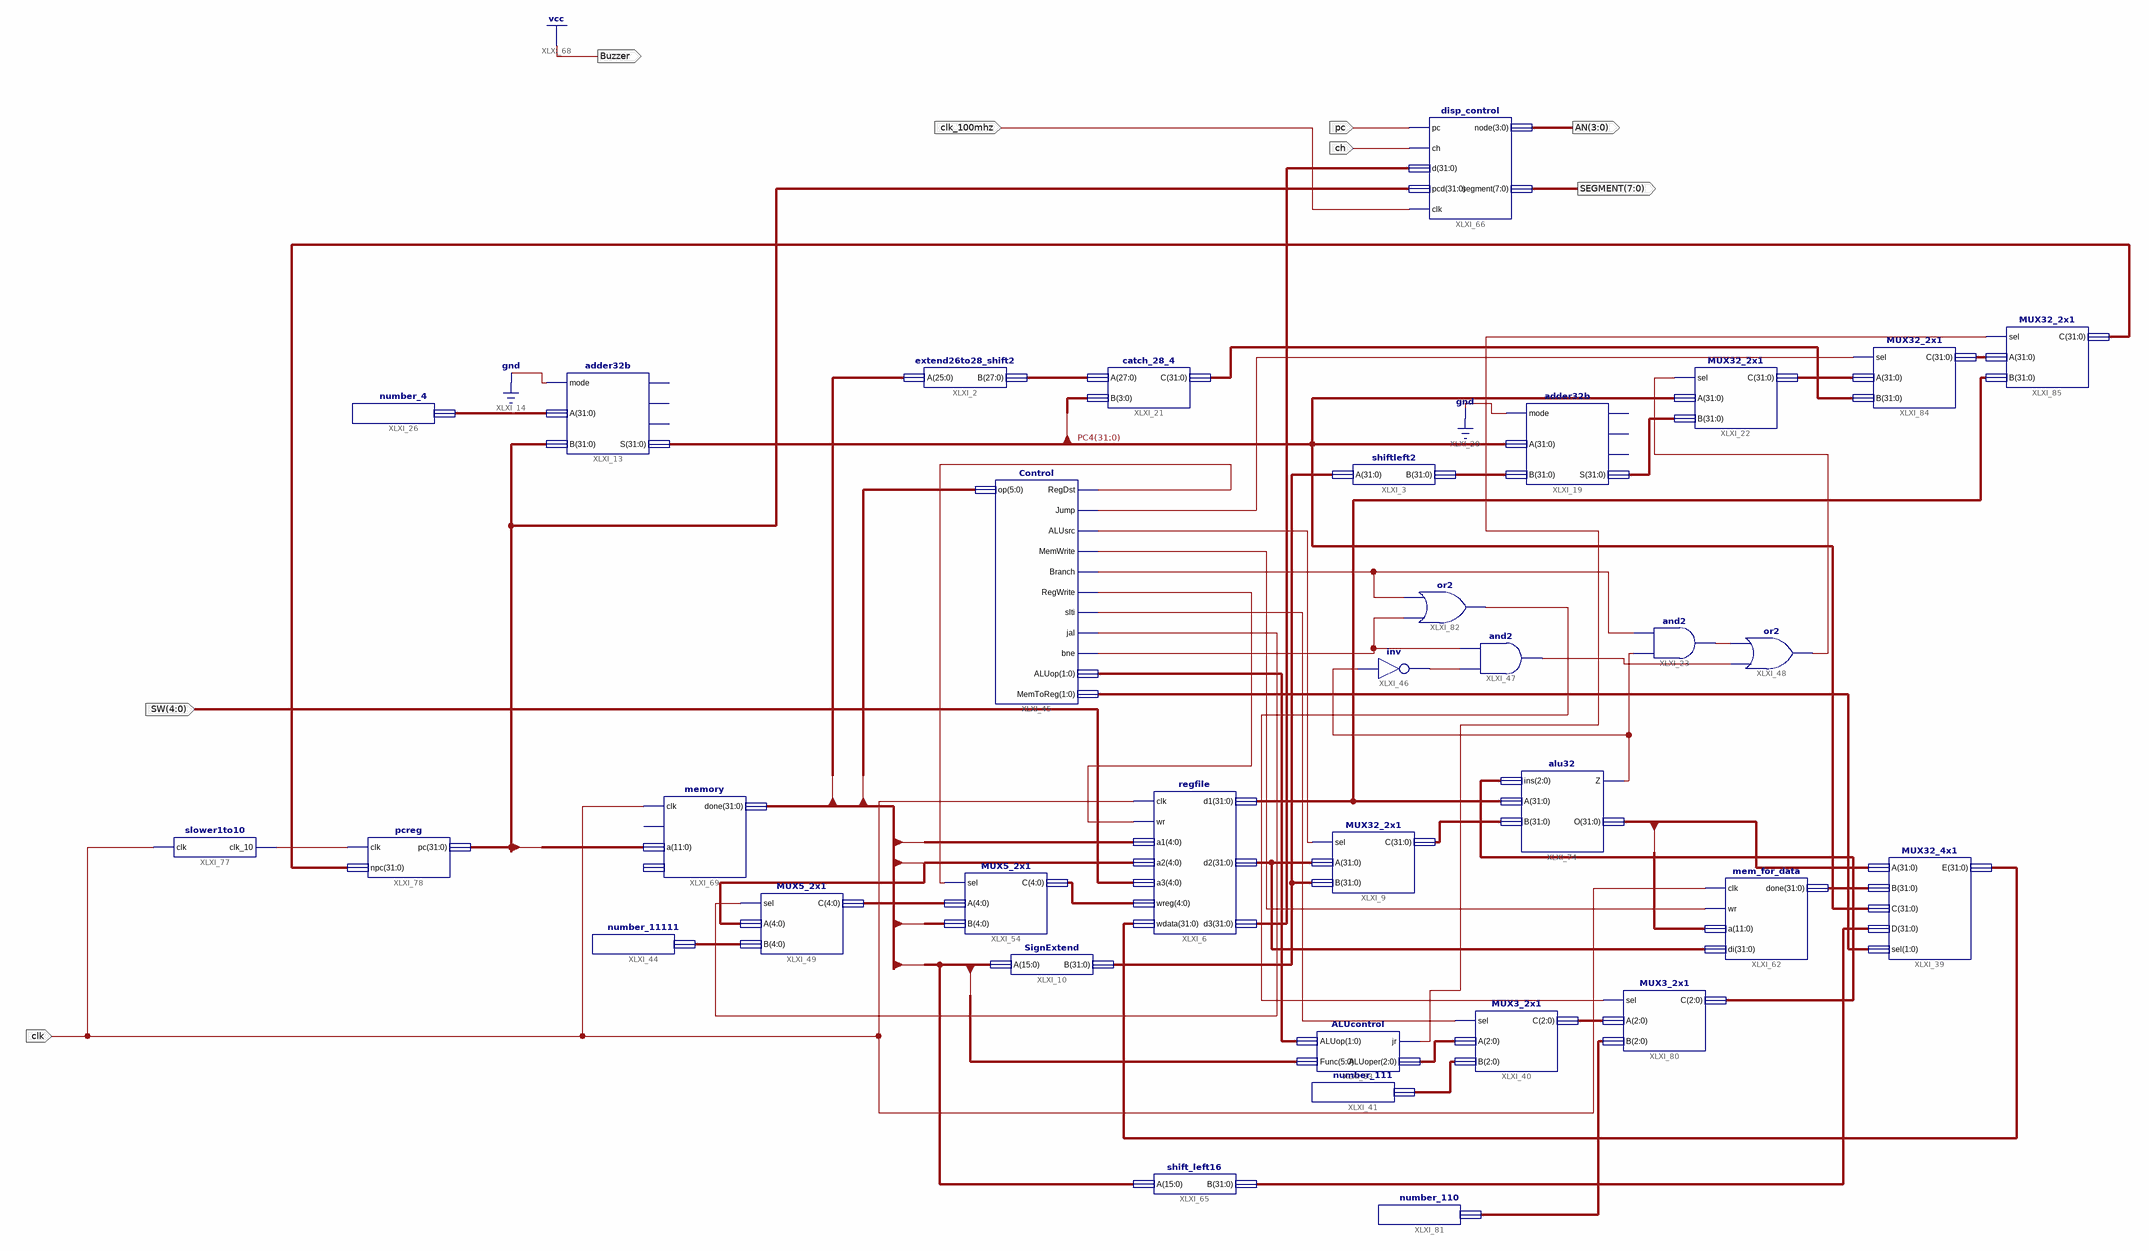
[diagram p0: schematic sheet 1]
// Xilinx ISE schematic top_for_single.sch (kintex7) as structural Verilog: 34 symbols, 8 ports
module top_for_single (
  input  clk,
  input  [4:0] SW,
  input  pc,
  input  ch,
  input  clk_100mhz,
  output [3:0] AN,
  output [7:0] SEGMENT,
  output Buzzer
);

  wire XLXN_13, XLXN_20, XLXN_23, XLXN_54, XLXN_87, XLXN_90, XLXN_99, XLXN_101, XLXN_102, XLXN_103, XLXN_104,
       XLXN_123, XLXN_124, XLXN_128, XLXN_129, XLXN_130, XLXN_133;
  wire [1:0] XLXN_25, XLXN_82;
  wire [2:0] XLXN_86, XLXN_89, XLXN_125, XLXN_126, XLXN_127;
  wire [4:0] XLXN_16, XLXN_92, XLXN_93;
  wire [27:0] XLXN_43;
  wire [31:0] addr, data3, instruction, PC4, pc_bus, XLXN_21, XLXN_22, XLXN_24, XLXN_28, XLXN_39, XLXN_46,
       XLXN_55, XLXN_56, XLXN_59, XLXN_70, XLXN_72, XLXN_109, XLXN_134, XLXN_136;

  extend26to28_shift2 XLXI_2 (.A(instruction[25:0]), .B(XLXN_43));
  shiftleft2 XLXI_3 (.A(XLXN_22), .B(XLXN_39));
  regfile XLXI_6 (
    .clk(clk), .wr(XLXN_20), .a1(instruction[25:21]), .a2(instruction[20:16]), .a3(SW), .wreg(XLXN_16),
    .wdata(XLXN_72), .d1(XLXN_24), .d2(XLXN_21), .d3(data3));
  MUX32_2x1 XLXI_9 (.sel(XLXN_23), .A(XLXN_21), .B(XLXN_22), .C(XLXN_28));
  SignExtend XLXI_10 (.A(instruction[15:0]), .B(XLXN_22));
  adder32b XLXI_13 (.mode(1'b0), .A(XLXN_59), .B(pc_bus), .S(PC4));  // open: CF, SF, ZF
  adder32b XLXI_19 (.mode(1'b0), .A(PC4), .B(XLXN_39), .S(XLXN_46));  // open: CF, SF, ZF
  catch_28_4 XLXI_21 (.A(XLXN_43), .B(PC4[31:28]), .C(XLXN_55));
  MUX32_2x1 XLXI_22 (.sel(XLXN_103), .A(PC4), .B(XLXN_46), .C(XLXN_56));
  and XLXI_23 (XLXN_102, XLXN_123, XLXN_129);
  number_4 XLXI_26 (.num(XLXN_59));
  MUX32_4x1 XLXI_39 (.A(addr), .B(XLXN_70), .C(PC4), .D(XLXN_109), .sel(XLXN_82), .E(XLXN_72));
  MUX3_2x1 XLXI_40 (.sel(XLXN_87), .A(XLXN_86), .B(XLXN_89), .C(XLXN_125));
  number_111 XLXI_41 (.A(XLXN_89));
  number_11111 XLXI_44 (.A(XLXN_93));
  Control XLXI_45 (
    .op(instruction[31:26]), .RegDst(XLXN_13), .Jump(XLXN_54), .ALUsrc(XLXN_23), .MemWrite(XLXN_99),
    .Branch(XLXN_129), .RegWrite(XLXN_20), .slti(XLXN_87), .jal(XLXN_90), .bne(XLXN_128), .ALUop(XLXN_25),
    .MemToReg(XLXN_82));
  not XLXI_46 (XLXN_104, XLXN_123);
  and XLXI_47 (XLXN_101, XLXN_104, XLXN_128);
  or XLXI_48 (XLXN_103, XLXN_101, XLXN_102);
  MUX5_2x1 XLXI_49 (.sel(XLXN_90), .A(instruction[20:16]), .B(XLXN_93), .C(XLXN_92));
  MUX5_2x1 XLXI_54 (.sel(XLXN_13), .A(XLXN_92), .B(instruction[15:11]), .C(XLXN_16));
  mem_for_data XLXI_62 (.clk(clk), .wr(XLXN_99), .a(addr[11:0]), .di(XLXN_21), .done(XLXN_70));
  shift_left16 XLXI_65 (.A(instruction[15:0]), .B(XLXN_109));
  disp_control XLXI_66 (.pc(pc), .ch(ch), .d(data3), .pcd(pc_bus), .node(AN), .segment(SEGMENT), .clk(clk_100mhz));
  memory XLXI_69 (.clk(clk), .a(pc_bus[11:0]), .done(instruction));  // open: wr, di
  alu32 XLXI_74 (.ins(XLXN_126), .A(XLXN_24), .B(XLXN_28), .Z(XLXN_123), .O(addr));
  slower1to10 XLXI_77 (.clk(clk), .clk_10(XLXN_124));
  pcreg XLXI_78 (.clk(XLXN_124), .npc(XLXN_136), .pc(pc_bus));
  MUX3_2x1 XLXI_80 (.sel(XLXN_130), .A(XLXN_125), .B(XLXN_127), .C(XLXN_126));
  number_110 XLXI_81 (.A(XLXN_127));
  or XLXI_82 (XLXN_130, XLXN_128, XLXN_129);
  ALUcontrol XLXI_83 (.ALUop(XLXN_25), .Func(instruction[5:0]), .jr(XLXN_133), .ALUoper(XLXN_86));
  MUX32_2x1 XLXI_84 (.sel(XLXN_54), .A(XLXN_56), .B(XLXN_55), .C(XLXN_134));
  MUX32_2x1 XLXI_85 (.sel(XLXN_133), .A(XLXN_134), .B(XLXN_24), .C(XLXN_136));

  assign Buzzer = 1'b1;
endmodule
